# EAGLE design cs4272-breakout-board (EAGLE 8.7.1)
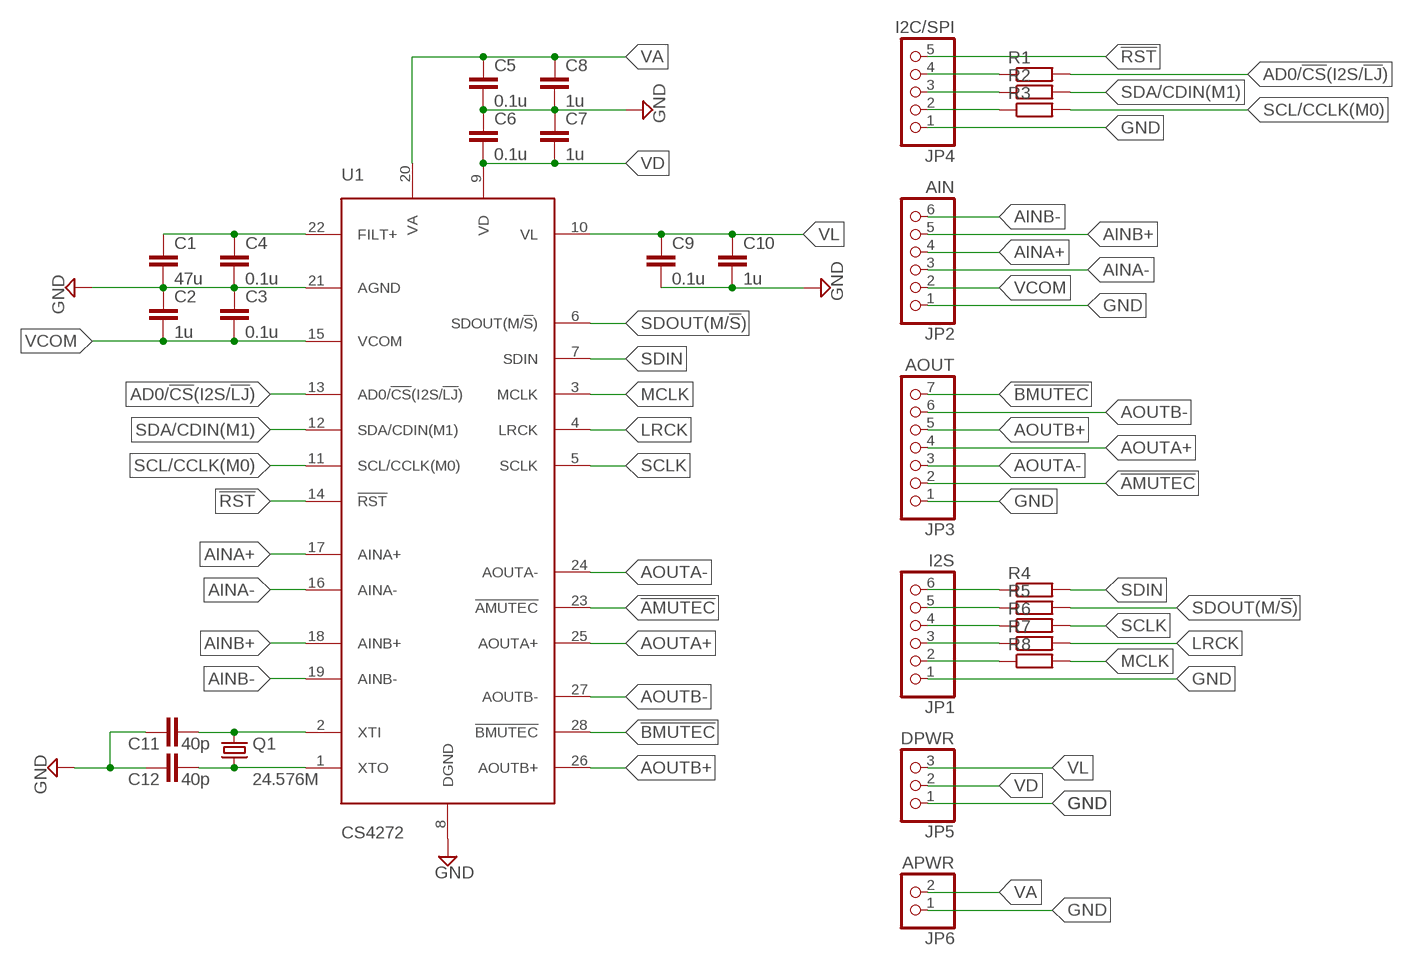
[diagram p0: schematic, sheet 1]

## Parts
C1  47u  C-EUC0603  [C0603]
C2  1u  C-EUC0603  [C0603]
C3  0.1u  C-EUC0603  [C0603]
C4  0.1u  C-EUC0603  [C0603]
C5  0.1u  C-EUC0603  [C0603]
C6  0.1u  C-EUC0603  [C0603]
C7  1u  C-EUC0603  [C0603]
C8  1u  C-EUC0603  [C0603]
C9  0.1u  C-EUC0603  [C0603]
C10  1u  C-EUC0603  [C0603]
C11  40p  C-EUC0603  [C0603]
C12  40p  C-EUC0603  [C0603]
JP1  I2S  PINHD-1X6  [1X06]
JP2  AIN  PINHD-1X6  [1X06]
JP3  AOUT  PINHD-1X7  [1X07]
JP4  I2C/SPI  PINHD-1X5  [1X05]
JP5  DPWR  PINHD-1X3  [1X03]
JP6  APWR  PINHD-1X2  [1X02]
Q1  24.576M  CRYSTALHC49S  [HC49/S]
R1  R-EU_R0603  [R0603]
R2  R-EU_R0603  [R0603]
R3  R-EU_R0603  [R0603]
R4  R-EU_R0603  [R0603]
R5  R-EU_R0603  [R0603]
R6  R-EU_R0603  [R0603]
R7  R-EU_R0603  [R0603]
R8  R-EU_R0603  [R0603]
U1  CS4272  [SOP65P640X120-28]

## Nets
!AMUTEC!: JP3.2 U1.23(!AMUTEC!)
!BMUTEC!: JP3.7 U1.28(!BMUTEC!)
!RST!: JP4.5 U1.14(!RST!)
AD0/!CS!(I2S/!LJ!): R1.2 U1.13(AD0/!CS!(I2S/!LJ!))
AINA+: JP2.4 U1.17(AINA+)
AINA-: JP2.3 U1.16(AINA-)
AINB+: JP2.5 U1.18(AINB+)
AINB-: JP2.6 U1.19(AINB-)
AOUTA+: JP3.4 U1.25(AOUTA+)
AOUTA-: JP3.3 U1.24(AOUTA-)
AOUTB+: JP3.5 U1.26(AOUTB+)
AOUTB-: JP3.6 U1.27(AOUTB-)
FILT+: C1.1 C4.1 U1.22(FILT+)
GND: C1.2 C2.1 C3.1 C4.2 C5.2 C6.1 C7.1 C8.2 C9.2 C10.2 C11.1 C12.1 JP1.1 JP2.1 JP3.1 JP4.1 JP5.1 JP6.1 U1.8(DGND) U1.21(AGND)
LRCK: R7.2 U1.4(LRCK)
MCLK: R8.2 U1.3(MCLK)
N$1: JP4.4 R1.1
N$2: JP4.3 R2.1
N$3: JP4.2 R3.1
N$4: JP1.2 R8.1
N$5: JP1.3 R7.1
N$6: JP1.4 R6.1
N$7: JP1.5 R5.1
N$8: JP1.6 R4.1
SCL/CCLK(M0): R3.2 U1.11(SCL/CCLK(M0))
SCLK: R6.2 U1.5(SCLK)
SDA/CDIN(M1): R2.2 U1.12(SDA/CDIN(M1))
SDIN: R4.2 U1.7(SDIN)
SDOUT(M/!S!): R5.2 U1.6(SDOUT(M/!S!))
VA: C5.1 C8.1 JP6.2 U1.20(VA)
VCOM: C2.2 C3.2 JP2.2 U1.15(VCOM)
VD: C6.2 C7.2 JP5.2 U1.9(VD)
VL: C9.1 C10.1 JP5.3 U1.10(VL)
XTI: C11.2 Q1.2 U1.2(XTI)
XTO: C12.2 Q1.1 U1.1(XTO)

## Library data of the parts
C1-C12 = rcl:C-EU: CAPACITOR, European symbol; SPICEPREFIX: C
JP1 JP2 = pinhead:PINHD-1X6: PIN HEADER
JP3 = pinhead:PINHD-1X7: PIN HEADER
JP4 = pinhead:PINHD-1X5: PIN HEADER
JP5 = pinhead:PINHD-1X3: PIN HEADER
JP6 = pinhead:PINHD-1X2: PIN HEADER
Q1 = crystal:CRYSTAL: CRYSTAL; OC_FARNELL: 1667008; OC_NEWARK: unknown
R1-R8 = rcl:R-EU_: RESISTOR, European symbol; SPICEPREFIX: R
U1 = cs4272:CS4272

## Board
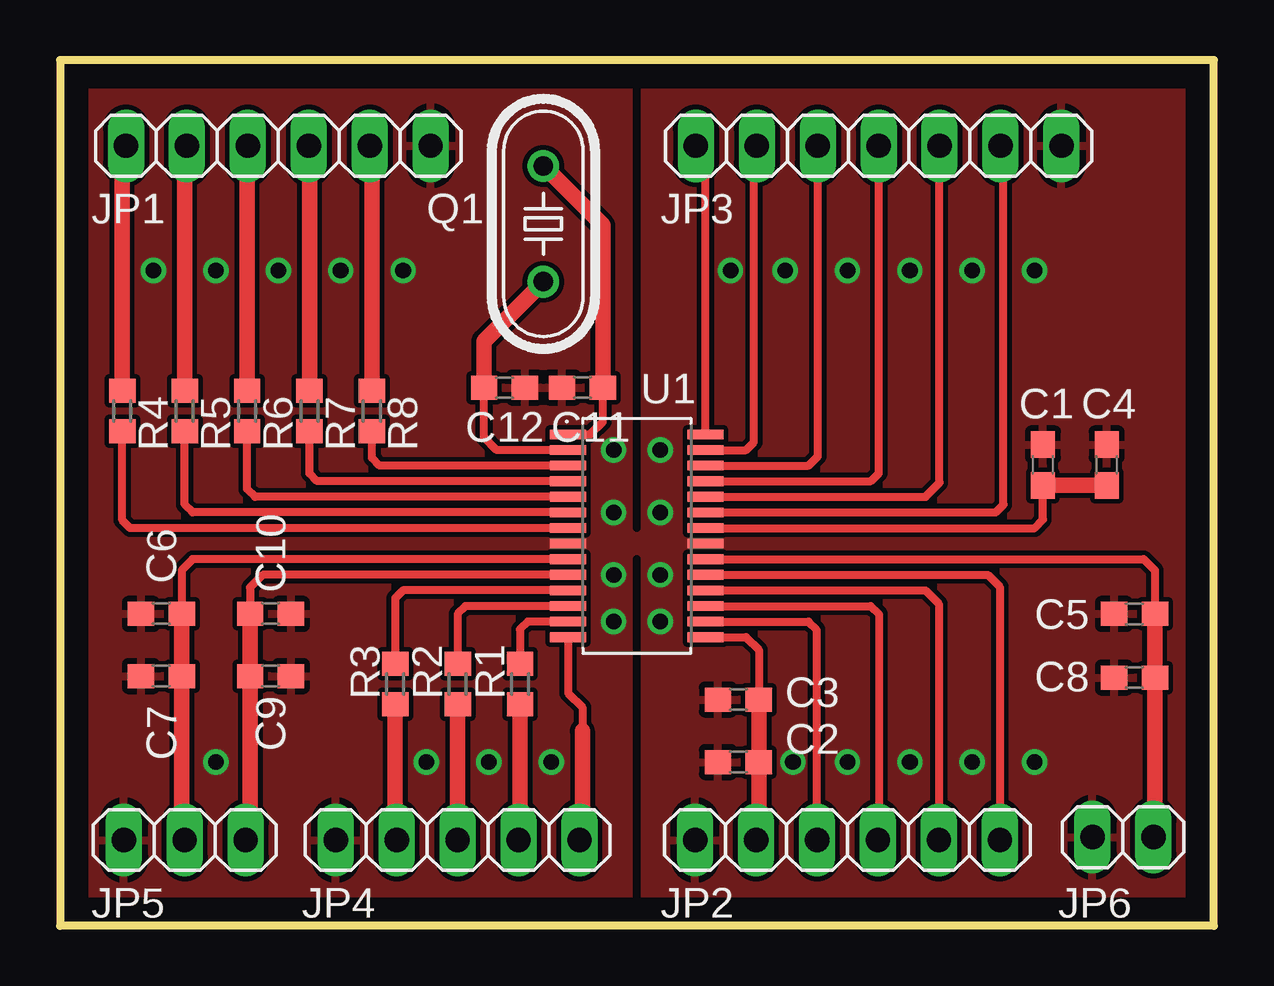
[diagram p1: board, top side]
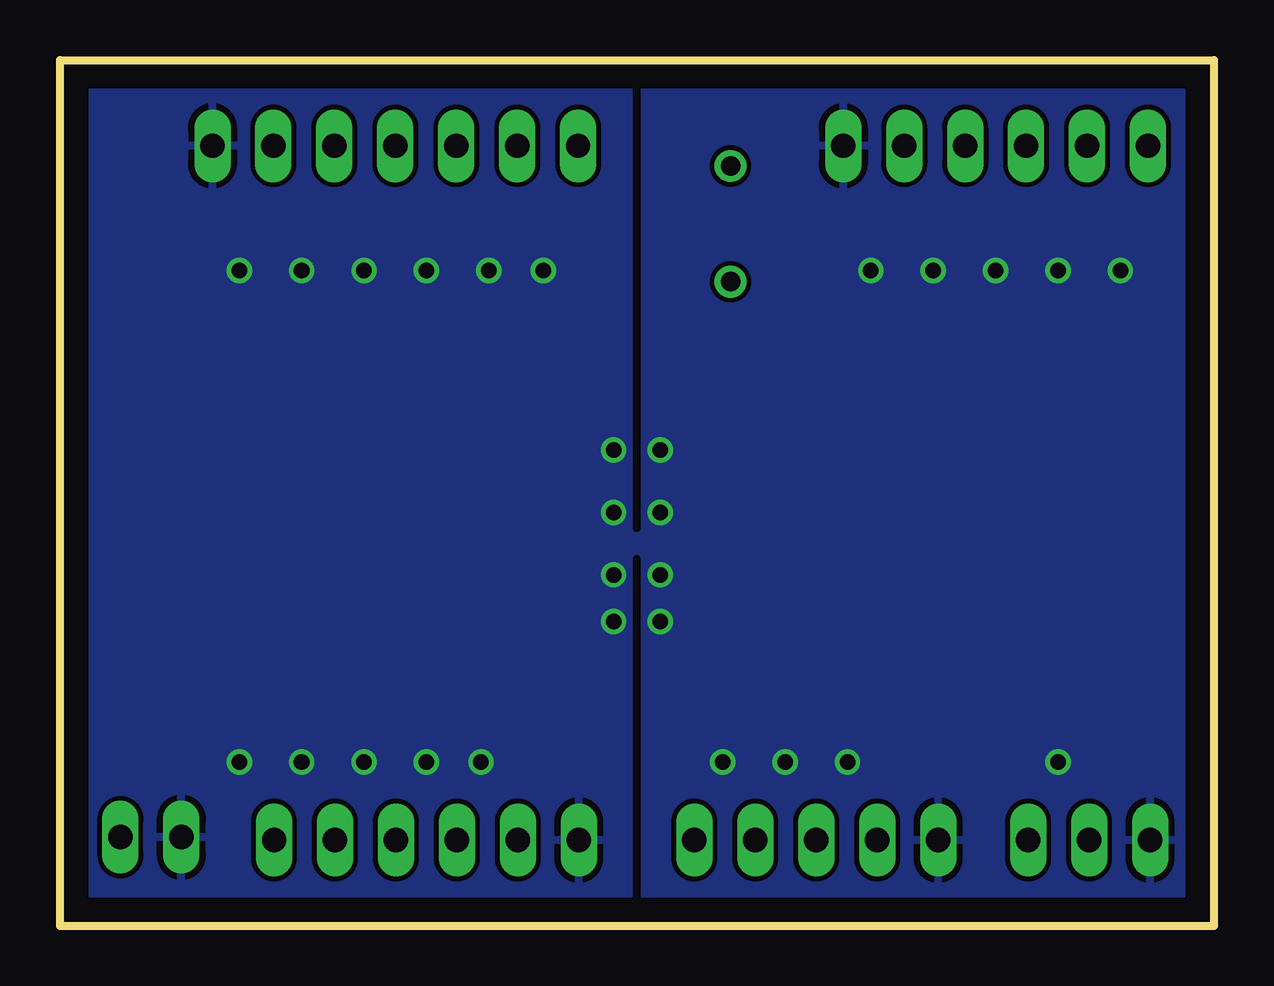
[diagram p2: board, bottom side, seen from below]

Size 48.1 x 36.07 mm. Coordinates in mm from the lower left corner, seen from the top.
Outline: 48.1,36.07 0,36.07 0,0 48.1,0 48.1,36.07
Copper layers (1*16): Top 0.035mm / dielectric 1.5mm / Bottom 0.035mm
Design rules "minimal": minimum track width 0.2mm, minimum drill 0.5mm, track to track 0.2mm, track to pad 0.2mm, pad to pad 0.2mm, via to via 0.2mm, smd to smd 0.2mm, copper to edge 40mil, drill to drill 0.6mm, minimum pad ring 10mil, minimum via ring 8mil, stop-mask expansion 4mil, vias tented up to drill 0mil, thermal gap 10mil
tRestrict: 2 lines
bRestrict: 2 lines

### Footprints (pad centres in the part's own frame; a part is rotated, then mirrored left to right if it is on the bottom)
C0603 = smd 1.1 x 1: 1 -0.85,0; 2 0.85,0
1X06 = drill 1.016 long: 1 -6.35,0; 2 -3.81,0; 3 -1.27,0; 4 1.27,0; 5 3.81,0; 6 6.35,0
1X07 = drill 1.016 long: 1 -7.62,0; 2 -5.08,0; 3 -2.54,0; 4 0,0; 5 2.54,0; 6 5.08,0; 7 7.62,0
1X05 = drill 1.016 long: 1 -5.08,0; 2 -2.54,0; 3 0,0; 4 2.54,0; 5 5.08,0
1X03 = drill 1.016 long: 1 -2.54,0; 2 0,0; 3 2.54,0
1X02 = drill 1.016 long: 1 -1.27,0; 2 1.27,0
HC49/S = drill 0.813: 1 -2.413,0; 2 2.413,0
R0603 = smd 1 x 1.1: 1 -0.85,0; 2 0.85,0
SOP65P640X120-28 = smd 1.499 x 0.407: 1 -2.865,4.225; 2 -2.865,3.575; 3 -2.865,2.925; 4 -2.865,2.275; 5 -2.865,1.625; 6 -2.865,0.975; 7 -2.865,0.325; 8 -2.865,-0.325; 9 -2.865,-0.975; 10 -2.865,-1.625; 11 -2.865,-2.275; 12 -2.865,-2.925; 13 -2.865,-3.575; 14 -2.865,-4.225; 15 2.865,-4.225; 16 2.865,-3.575; 17 2.865,-2.925; 18 2.865,-2.275; 19 2.865,-1.625; 20 2.865,-0.975; 21 2.865,-0.325; 22 2.865,0.325; 23 2.865,0.975; 24 2.865,1.625; 25 2.865,2.275; 26 2.865,2.925; 27 2.865,3.575; 28 2.865,4.225

### Placement (x,y rotation side)
C1  43.63,19.2 90 top
C2  28.27,6.82 0 top
C3  28.27,9.43 0 top
C4  40.98,19.2 90 top
C5  44.79,13 180 top
C6  4.23,13 0 top
C7  4.23,10.4 0 top
C8  44.79,10.34 180 top
C9  8.78,13 0 top
C10  8.78,10.4 0 top
C11  18.52,22.43 180 top
C12  21.77,22.43 0 top
JP1  9.1,32.5 180 top
JP2  32.83,3.57 0 top
JP3  34.12,32.5 180 top
JP4  16.57,3.57 0 top
JP5  5.2,3.57 0 top
JP6  44.31,3.69 0 top
Q1  20.15,29.25 270 top
R1  19.18,10.07 90 top
R2  16.57,10.07 90 top
R3  13.98,10.07 90 top
R4  2.6,21.45 270 top
R5  5.2,21.45 270 top
R6  7.8,21.45 270 top
R7  10.4,21.45 270 top
R8  13,21.45 270 top
U1  24.05,16.25 0 top

### Tracks (layer width: path | path; a pad name or v marks a point on that pad's centre or on a via)
!AMUTEC!
  Top 0.325: U1.23 39,17.23 39.33,17.55 39.33,32.3 39.21,32.41 JP3.2
!BMUTEC!
  Top 0.325: U1.28 26.91,32.09 JP3.7
!RST!
  Top 0.325: U1.14 21.18,9.69 21.77,9.1 21.77,8.12
  Top 0.65: 21.77,8.12 21.77,3.69 JP4.5
AD0/!CS!(I2S/!LJ!)
  Top 0.325: U1.13 19.5,12.68 19.18,12.35 R1.2
AINA+
  Top 0.325: U1.17 33.8,13.32 34.12,13 34.12,3.6 JP2.4
AINA-
  Top 0.325: U1.16 31.2,12.68 31.52,12.35 31.52,3.6 JP2.3
AINB+
  Top 0.325: U1.18 36.08,13.98 36.64,13.41 JP2.5
AINB-
  Top 0.325: U1.19 38.68,14.62 39.18,14.12 JP2.6
AOUTA+
  Top 0.325: JP3.4 34.12,18.85 33.8,18.52 U1.25
AOUTA-
  Top 0.325: U1.24 36.08,17.88 36.67,18.46 JP3.3
AOUTB+
  Top 0.325: JP3.5 31.59,19.56 31.2,19.18 U1.26
AOUTB-
  Top 0.325: U1.27 28.6,19.82 28.93,20.15 28.93,32.38 JP3.6
FILT+
  Top 0.325: U1.22 40.62,16.57 40.98,16.93 C4.1
  Top 0.65: C4.1 C1.1
GND  (via drill 0.65)
  other vias: 23.07,19.82 25.02,19.82 25.02,17.23 23.07,17.23 23.07,14.62 25.02,14.62 23.07,12.68 25.02,12.68 3.9,27.3 6.5,27.3 9.1,27.3 11.7,27.3 27.95,27.3 30.22,27.3 32.83,27.3 35.43,27.3 38.03,27.3 40.62,27.3 6.5,6.82 15.27,6.82 17.88,6.82 20.47,6.82 30.55,6.82 32.83,6.82 35.43,6.82 38.03,6.82 14.3,27.3 40.62,6.82
  pour Top: 0,0 48.1,0 48.1,36.07 0,36.07
  pour Bottom: 0,0 48.1,0 48.1,36.07 0,36.07
LRCK
  Top 0.325: U1.4 10.73,18.52 10.4,18.85 R7.2
MCLK
  Top 0.325: U1.3 13.32,19.18 13,19.5 R8.2
N$1
  Top 0.65: R1.1 19.18,3.63 JP4.4
N$2
  Top 0.65: R2.1 JP4.3
N$3
  Top 0.65: R3.1 13.98,3.63 JP4.2
N$4
  Top 0.65: R8.1 13,32.41 JP1.2
N$5
  Top 0.65: R7.1 10.4,32.47 JP1.3
N$6
  Top 0.65: R6.1 7.8,32.47 JP1.4
N$7
  Top 0.65: R5.1 5.2,32.41 JP1.5
N$8
  Top 0.65: R4.1 2.6,32.35 JP1.6
SCL/CCLK(M0)
  Top 0.325: U1.11 14.3,13.98 13.98,13.65 R3.2
SCLK
  Top 0.325: U1.5 8.12,17.88 7.8,18.2 R6.2
SDA/CDIN(M1)
  Top 0.325: U1.12 16.9,13.32 16.57,13 R2.2
SDIN
  Top 0.325: U1.7 2.93,16.57 2.6,16.9 R4.2
SDOUT(M/!S!)
  Top 0.325: U1.6 5.53,17.23 5.2,17.55 R5.2
VA
  Top 0.325: U1.20 45.18,15.27 45.64,14.81 C5.1
  Top 0.65: JP6.2 45.64,3.75 C8.1 C5.1
VCOM
  Top 0.325: U1.15 28.6,12.02 29.12,11.5 C3.2
  Top 0.65: JP2.2 29.12,3.68 C2.2 C3.2
VD
  Top 0.325: U1.9 5.53,15.27 5.08,14.82 C6.2
  Top 0.65: C6.2 C7.2 5.08,3.7 JP5.2
VL
  Top 0.325: U1.10 8.45,14.62 7.92,14.1 C9.1
  Top 0.65: C9.1 C10.1 7.92,3.76 JP5.3
XTI
  Top 0.325: U1.2 18.2,19.82 17.68,20.35 C11.2
  Top 0.65: C11.2 17.68,24.36 Q1.2
XTO
  Top 0.325: U1.1 22.1,20.48 22.62,21 C12.2
  Top 0.65: C12.2 22.62,29.19 Q1.1